# EAGLE design UARTOptoCoupler (EAGLE 6.4)
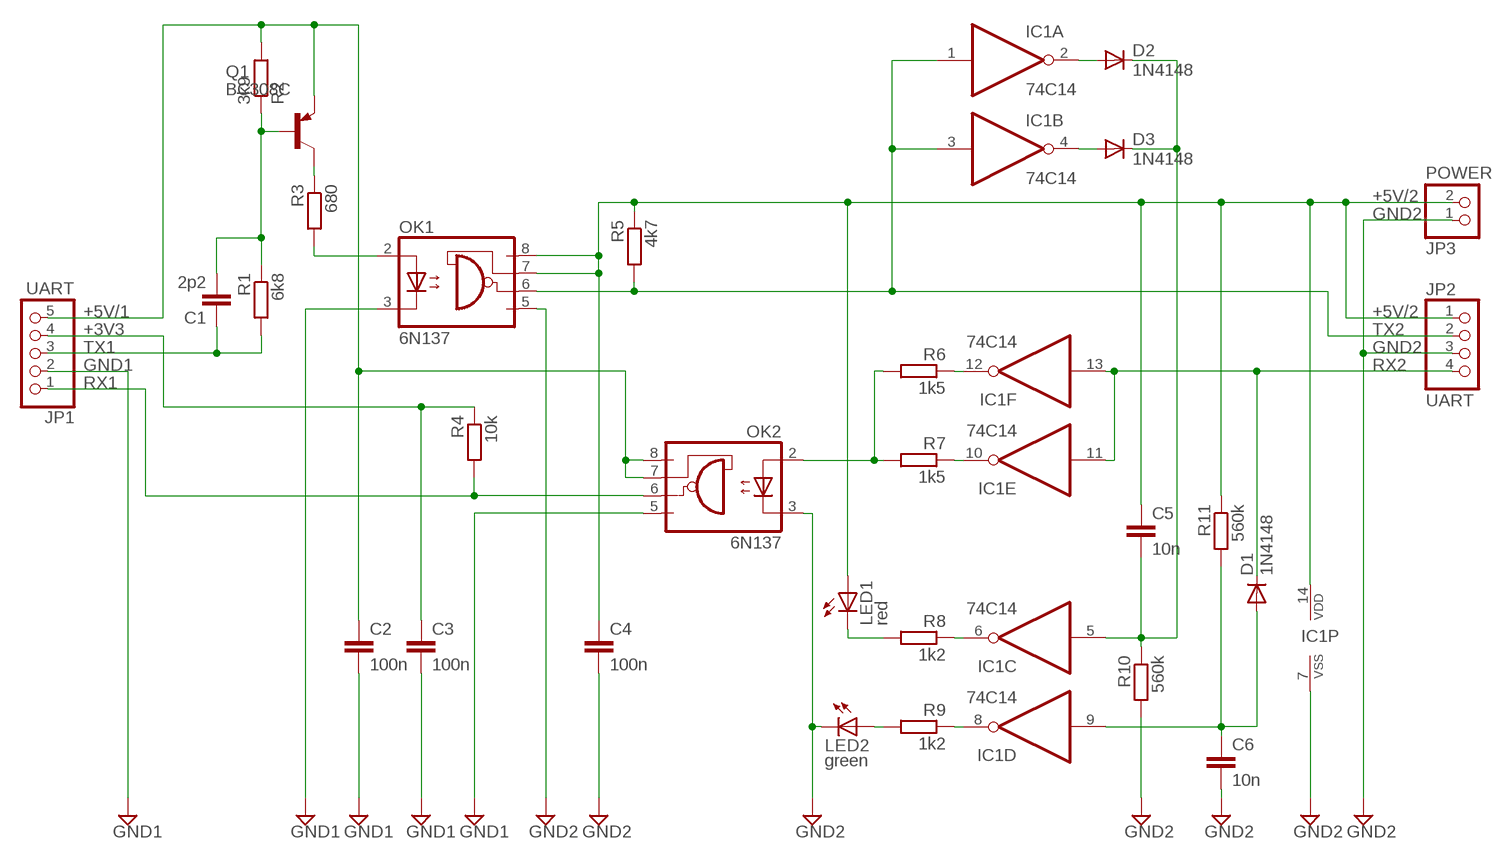
[diagram p0: schematic, sheet 1]

## Parts
C1  2p2  C-EU025-024X044  [C025-024X044]
C2  100n  C-EU050-025X075  [C050-025X075]
C3  100n  C-EU050-025X075  [C050-025X075]
C4  100n  C-EU050-025X075  [C050-025X075]
C5  10n  C-EU050-025X075  [C050-025X075]
C6  10n  C-EU050-025X075  [C050-025X075]
D1  1N4148  1N4148DO35-10  [DO35-10]
D2  1N4148  1N4148DO35-10  [DO35-10]
D3  1N4148  1N4148DO35-10  [DO35-10]
IC1  74C14  4584N  [DIL14]
JP1  UART  PINHD-1X5  [1X05]
JP2  UART  PINHD-1X4/90  [1X04/90]
JP3  POWER  PINHD-1X2  [1X02]
LED1  red  LED3MM  [LED3MM]
LED2  green  LED3MM  [LED3MM]
OK1  6N137  [DIL08]
OK2  6N137  [DIL08]
Q1  BC308C  BC307  [TO92]
R1  6k8  R-EU_0207/10  [0207/10]
R2  3k9  R-EU_0207/10  [0207/10]
R3  680  R-EU_0207/10  [0207/10]
R4  10k  R-EU_0207/10  [0207/10]
R5  4k7  R-EU_0207/10  [0207/10]
R6  1k5  R-EU_0207/10  [0207/10]
R7  1k5  R-EU_0207/10  [0207/10]
R8  1k2  R-EU_0207/10  [0207/10]
R9  1k2  R-EU_0207/10  [0207/10]
R10  560k  R-EU_0207/10  [0207/10]
R11  560k  R-EU_0207/10  [0207/10]

## Nets
+3V3: C3.1 JP1.4 R4.1
+5V/1: C2.1 JP1.5 OK2.7(VE) OK2.8(VCC) Q1.1(E) R2.2
+5V/2: C4.1 C5.1 IC1.14(P:VDD) JP2.1 JP3.2 LED1.A OK1.7(VE) OK1.8(VCC) R5.1 R11.1
GND1: C2.2 C3.2 JP1.2 OK1.3(C) OK2.5(GND)
GND2: C4.2 C6.2 IC1.7(P:VSS) JP2.3 JP3.1 LED2.K(C) OK1.5(GND) OK2.3(C) R10.2
N1: C1.2 Q1.2(B) R1.1 R2.1
N$1: OK1.2(A) R3.2
N$2: LED1.K(C) R8.2
N$3: Q1.3(C) R3.1
N$4: OK2.2(A) R6.2 R7.2
N$5: C5.2 D2.C D3.C IC1.5(C:I) R10.1
N$6: IC1.12(F:O) R6.1
N$7: IC1.10(E:O) R7.1
N$9: C6.1 D1.A IC1.9(D:I) R11.2
N$10: IC1.6(C:O) R8.1
N$11: IC1.8(D:O) R9.1
N$12: D3.A IC1.4(B:O)
N$13: LED2.A R9.2
N$14: D2.A IC1.2(A:O)
RX1: JP1.1 OK2.6(VO) R4.2
RX2: D1.C IC1.11(E:I) IC1.13(F:I) JP2.4
TX1: C1.1 JP1.3 R1.2
TX2: IC1.1(A:I) IC1.3(B:I) JP2.2 OK1.6(VO) R5.2

## Library data of the parts
C1-C6 = rcl:C-EU: CAPACITOR, European symbol
D1-D3 = diode:1N4148: DIODE high speed (Philips)
IC1 = 45xx:4584: Hex SCHMITT TRIGGER (74C14)
JP1 = pinhead:PINHD-1X5: PIN HEADER
JP2 = pinhead:PINHD-1X4: PIN HEADER
JP3 = pinhead:PINHD-1X2: PIN HEADER
LED1 LED2 = led:LED: LED OSRAM: - CHIPLED LG R971, LG N971, LY N971, LG Q971, LY Q971, LO R971, LY R971 LH N974, LH R974 LS Q976, LO Q976, LY Q976 LO Q996 - Hyper CHIPLED LW Q18S LB Q993, LB Q99A, LB R99A - SideLED LS A670, LO A670, LY A670, LG A670, LP A670 LB A673, LV A673, LT A673, LW A673 LH A674 LY A675 LS A676, LA A676, LO A676, LY A676, LW A676 LS A679, LY A679, LG A679 - Hyper Micro SIDELED® LS Y876, LA Y876, LO Y876, LY Y876 LT Y87S - SmartLED LW L88C, LW L88S LB L89C, LB L89S, LG L890 LS L89K, LO L89K, LY L89K LS L896, LA L896, LO L896, LY L896 - TOPLED LS T670, LO T670, LY T670, LG T670, LP T670 LSG T670, LSP T670, LSY T670, LOP T670, LYG T670 LG T671, LOG T671, LSG T671 LB T673, LV T673, LT T673, LW T673 LH T674 LS T676, LA T676, LO T676, LY T676, LB T676, LH T676, LSB T676, LW T676 LB T67C, LV T67C, LT T67C, LS T67K, LO T67K, LY T67K, LW E67C LS E67B, LA E67B, LO E67B, LY E67B, LB E67C, LV E67C, LT E67C LW T67C LS T679, LY T679, LG T679 LS T770, LO T770, LY T770, LG T770, LP T770 LB T773, LV T773, LT T773, LW T773 LH T774 LS E675, LA E675, LY E675, LS T675 LS T776, LA T776, LO T776, LY T776, LB T776 LHGB T686 LT T68C, LB T68C - Hyper Mini TOPLED® LB M676 - Mini TOPLED Santana® LG M470 LS M47K, LO M47K, LY M47K Source: http://www.osram.convergy.de LUXEON: - LUMILED® LXK2-PW12-R00, LXK2-PW12-S00, LXK2-PW14-U00, LXK2-PW14-V00 LXK2-PM12-R00, LXK2-PM12-S00, LXK2-PM14-U00 LXK2-PE12-Q00, LXK2-PE12-R00, LXK2-PE12-S00, LXK2-PE14-T00, LXK2-PE14-U00 LXK2-PB12-K00, LXK2-PB12-L00, LXK2-PB12-M00, LXK2-PB14-N00, LXK2-PB14-P00, LXK2-PB14-Q00 LXK2-PR12-L00, LXK2-PR12-M00, LXK2-PR14-Q00, LXK2-PR14-R00 LXK2-PD12-Q00, LXK2-PD12-R00, LXK2-PD12-S00 LXK2-PH12-R00, LXK2-PH12-S00 LXK2-PL12-P00, LXK2-PL12-Q00, LXK2-PL12-R00 Source: www.luxeon.com KINGBRIGHT: KA-3528ASYC Source: www.kingbright.com
OK1 OK2 = optocoupler:6N137: MOTOROLA OPTO COUPLER; MPN: 6N137; OC_FARNELL: 1328376; OC_NEWARK: 52M1895
Q1 = transistor-pnp:BC307: PNP Transistor
R1-R11 = rcl:R-EU_: RESISTOR, European symbol

## Board
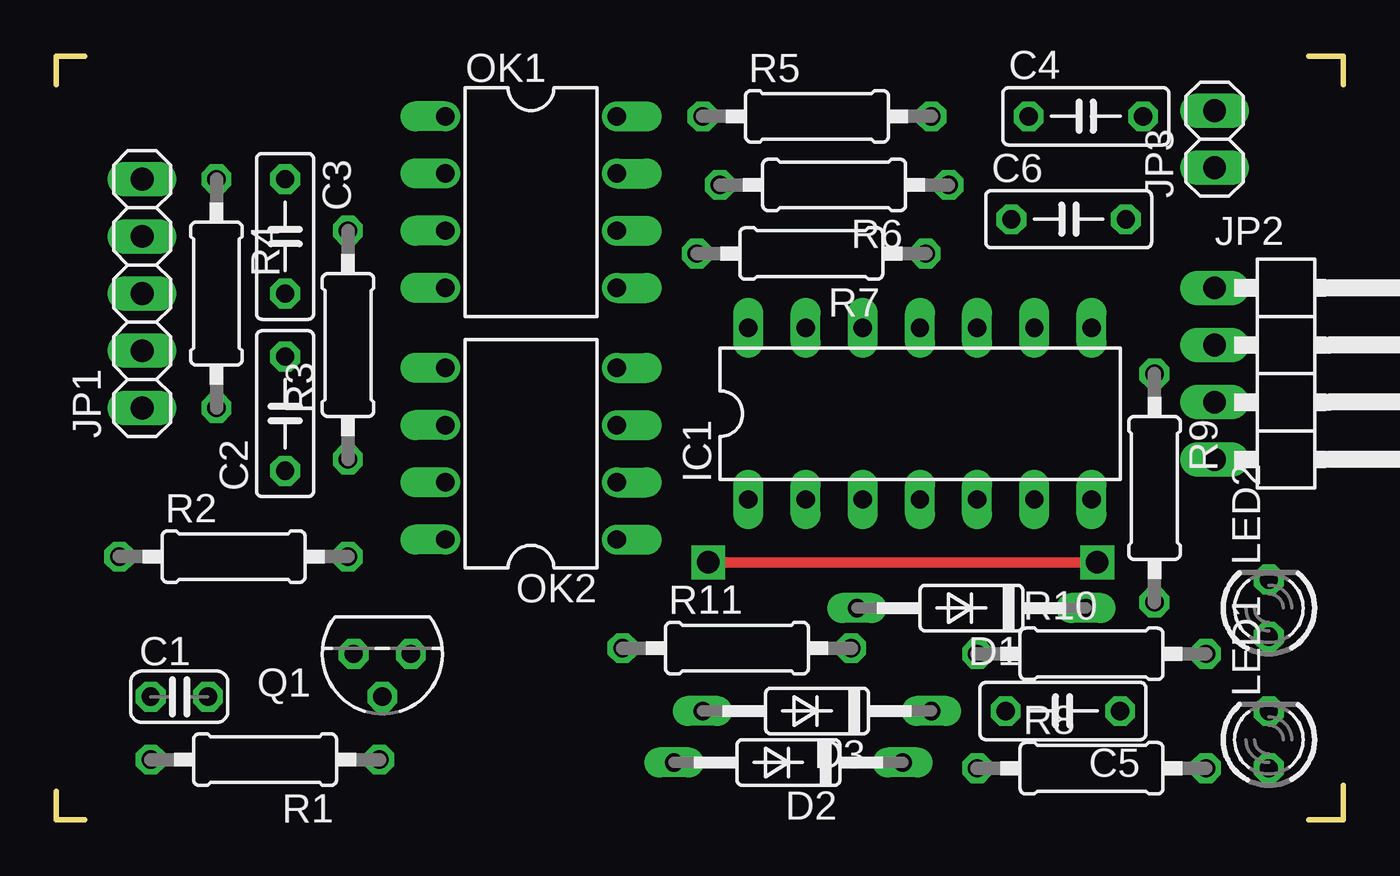
[diagram p1: board, top side]
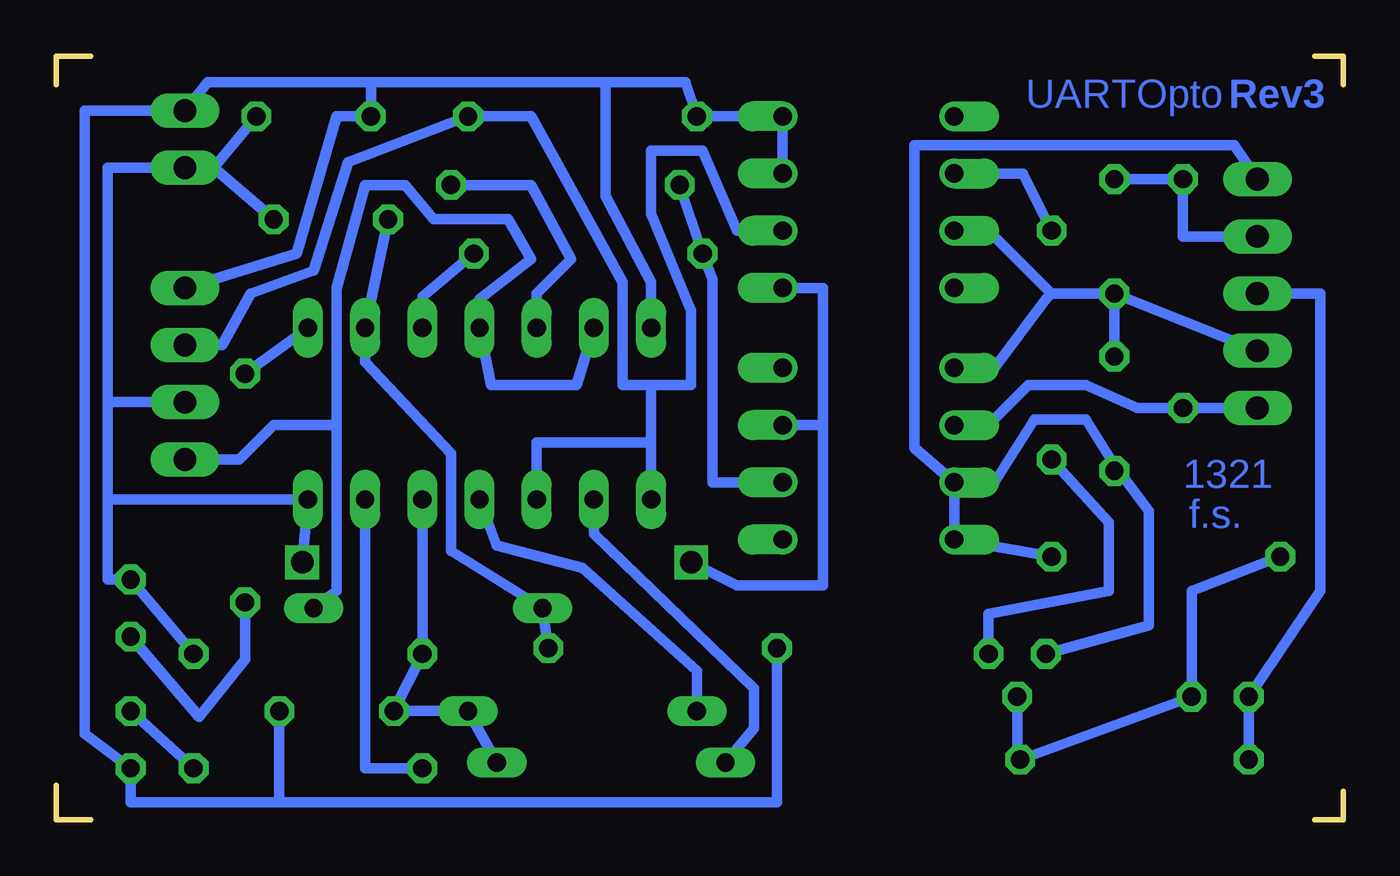
[diagram p2: board, bottom side, seen from below]

Size 57.15 x 33.91 mm. Coordinates in mm from the lower left corner, seen from the top.
Outline: 0,32.64 0,33.91 1.27,33.91
Outline: 55.63,33.91 57.15,33.91 57.15,32.64
Outline: 0,1.27 0,0 1.27,0
Outline: 55.63,0 57.15,0 57.15,1.52
Copper layers (1*16): Top 0.035mm / dielectric 1.5mm / Bottom 0.035mm
Design rules "MyLayout *": minimum track width 18mil, minimum drill 24mil, track to track 8mil, track to pad 8mil, pad to pad 8mil, via to via 8mil, smd to smd 8mil, copper to edge 20mil, drill to drill 8mil, minimum pad ring 10mil, minimum via ring 8mil, stop-mask expansion 4mil, vias tented up to drill 0mil, thermal gap 10mil

### Footprints (pad centres in the part's own frame; a part is rotated, then mirrored left to right if it is on the bottom)
C025-024X044 = drill 0.813 octagon: 1 -1.27,0; 2 1.27,0
C050-025X075 = drill 0.813 octagon: 1 -2.54,0; 2 2.54,0
DO35-10 = drill 0.813 long: A 5.08,0; C -5.08,0
DIL14 = drill 0.813 long: 1 -7.62,-3.81; 2 -5.08,-3.81; 3 -2.54,-3.81; 4 0,-3.81; 5 2.54,-3.81; 6 5.08,-3.81; 7 7.62,-3.81; 8 7.62,3.81; 9 5.08,3.81; 10 2.54,3.81; 11 0,3.81; 12 -2.54,3.81; 13 -5.08,3.81; 14 -7.62,3.81
1X05 = drill 1.016 long: 1 -5.08,0; 2 -2.54,0; 3 0,0; 4 2.54,0; 5 5.08,0
1X04/90 = drill 1.016 long: 1 -3.81,-3.81; 2 -1.27,-3.81; 3 1.27,-3.81; 4 3.81,-3.81
1X02 = drill 1.016 long: 1 -1.27,0; 2 1.27,0
LED3MM = drill 0.813 octagon: A -1.27,0; K 1.27,0
DIL08 = drill 0.813 offset: 1 -3.81,-3.81; 2 -1.27,-3.81; 3 1.27,-3.81; 4 3.81,-3.81; 5 3.81,3.81; 6 1.27,3.81; 7 -1.27,3.81; 8 -3.81,3.81
TO92 = drill 0.813 octagon: 1 1.27,0; 2 0,1.905; 3 -1.27,0
0207/10 = drill 0.813 octagon: 1 -5.08,0; 2 5.08,0

### Placement (x,y rotation side)
C1  5.46,5.46 0 top
C2  10.16,18.03 90 top
C3  10.16,25.91 270 top
C4  45.72,31.24 0 top
C5  44.7,4.83 180 top
C6  44.96,26.67 0 top
D1  40.64,9.4 180 top
D2  32.51,2.54 180 top
D3  33.78,4.83 180 top
IC1  38.35,18.03 0 top
JP1  3.81,23.37 90 top
JP2  55.24,19.81 270 top
JP3  51.44,30.23 90 top
LED1  53.85,3.56 90 top
LED2  53.85,9.4 90 top
OK1  21.08,27.43 270 top
OK2  21.08,16.26 90 top
Q1  14.48,7.37 180 top
R1  9.27,2.67 180 top
R2  7.87,11.68 0 top
R3  12.95,21.08 90 top
R4  7.11,23.37 270 top
R5  33.78,31.24 0 top
R6  34.54,28.19 180 top
R7  33.53,25.15 180 top
R8  45.97,2.29 0 top
R9  48.77,14.73 270 top
R10  45.97,7.37 0 top
R11  30.23,7.62 0 top

### Tracks (layer width: path | path; a pad name or v marks a point on that pad's centre or on a via)
+3V3
  Bottom 0.457: JP1.4 7.11,25.91 R4.1 C3.1
+5V/1
  Bottom 0.457: OK2.7 OK2.8 R2.2 | OK2.7 19.05,16.51 19.05,29.97 4.83,29.97 JP1.5 | Q1.1 8.64,8.64 8.64,13.72 10.16,15.75 | 10.16,15.75 11.43,17.78 13.72,17.78 15.49,14.99 OK2.7 | C2.1 10.16,15.75
+5V/2
  Bottom 0.457: OK1.7 OK1.8 R5.1 29.21,32.77 32.77,32.77 | 32.77,32.77 32.77,27.69 30.73,23.88 IC1.14 | 43.18,32.77 32.77,32.77 | 43.18,32.77 C4.1 44.7,31.24 46.48,25.15 JP2.1 | JP3.2 50.42,32.77 43.18,32.77 | 51.31,31.5 JP3.2 | JP3.2 55.88,31.5 55.88,3.81 LED1.A 53.85,0.76 47.24,0.76 | R11.1 25.15,0.76 47.24,0.76 | C5.1 47.24,0.76
GND1
  Bottom 0.457: JP1.2 C3.2 | 12.95,23.37 15.75,26.16 OK1.3 | OK2.5 15.49,20.07 13.21,23.11 12.95,23.37 | 12.95,23.37 C3.2 | C2.2 C3.2
GND2  (via drill 1)
  Top 0.457: v46.23,11.43 v28.96,11.43
  Bottom 0.457: 50.16,28.96 JP3.1 54.86,28.96 54.86,19.81 54.86,18.54 | 50.16,28.96 C4.2 | OK1.5 23.11,23.62 23.11,17.53 | OK2.3 23.11,17.53 | 23.11,17.53 23.11,10.41 26.92,10.41 v28.96,11.43 | 54.86,14.22 IC1.7 v46.23,11.43 | 54.86,18.54 54.86,14.22 | 54.86,14.22 54.86,10.67 LED2.K R10.2 | JP2.3 54.86,18.54 | 50.16,28.96 C6.2
N1
  Bottom 0.457: R2.1 6.73,10.16 C1.2 R1.1 14.48,2.67 Q1.2
N$1
  Bottom 0.457: R3.2 14.22,28.7 OK1.2
N$2
  Bottom 0.457: R8.2 LED1.K
N$3
  Bottom 0.457: R3.1 10.41,13.21 10.41,10.16 15.75,9.14 Q1.3
N$4
  Bottom 0.457: OK2.2 28,14.99 28,24 R7.2 R6.2
N$5
  Bottom 0.457: D2.C D3.C C5.2 R10.1 IC1.5
N$6
  Bottom 0.457: IC1.12 35.81,23.37 34.29,24.89 36.07,28.19 R6.1
N$7
  Bottom 0.457: R7.1 40.89,23.24 IC1.10
N$9
  Bottom 0.457: R11.2 D1.A 39.62,11.94 39.62,16.26 43.43,20.32 IC1.9 C6.1
N$10
  Bottom 0.457: IC1.6 43.43,2.29 R8.1
N$11
  Bottom 0.457: IC1.8 R9.1
N$12
  Bottom 0.457: D3.A 28.7,6.6 33.78,11.18 37.59,12.19 IC1.4
N$13
  Bottom 0.457: R9.2 48.77,7.11 50.8,4.57 LED2.A
N$14
  Bottom 0.457: D2.A 26.16,4.06 26.16,5.84 33.27,12.7 IC1.2
RX1
  Bottom 0.457: JP1.1 R4.2 9.14,18.29 11.43,19.3 13.97,19.3 15.75,17.53 OK2.6
RX2
  Bottom 0.457: IC1.13 34.04,19.3 37.85,19.3 IC1.11 38.35,23.11 36.07,24.89 37.08,26.67 40.39,26.67 41.66,28.19 43.43,28.19 44.7,23.62 44.7,17.53 | D1.C 44.7,10.16 44.7,17.53 | 44.7,17.53 47.5,17.53 49.02,16 JP2.4
TX1
  Bottom 0.457: JP1.3 1.02,23.37 1.02,10.16 C1.1 R1.2
TX2
  Bottom 0.457: IC1.1 30.73,16.76 | 30.73,16.76 35.81,16.76 IC1.3 | OK1.6 26.92,26.16 28.45,29.72 30.73,29.72 30.73,26.92 28.96,22.61 28.96,19.3 30.73,19.3 | 30.73,19.3 30.73,16.76 | 30.73,19.3 32,19.3 32,23.88 36.07,31.24 R5.2 44.2,29.21 45.72,24.38 48.51,23.37 49.78,21.08 JP2.2

### Text on the board
Bottom: Rev3 | UARTOpto | 1321 | f.s.
Document: +5V/1 | +5V/2 | +3V3 | GND2 | TX1 | +5V/2 | GND1 | TX2 | RX1 | GND2 | RX2
tDocu: +5V | +3V3 | +5V | Tx | Tx | GND | GND | Rx | Rx | Rx | Tx